# Altium schematic sheet schematic.SchDoc
size A3; SheetNumber: 6; SheetTotal: 29
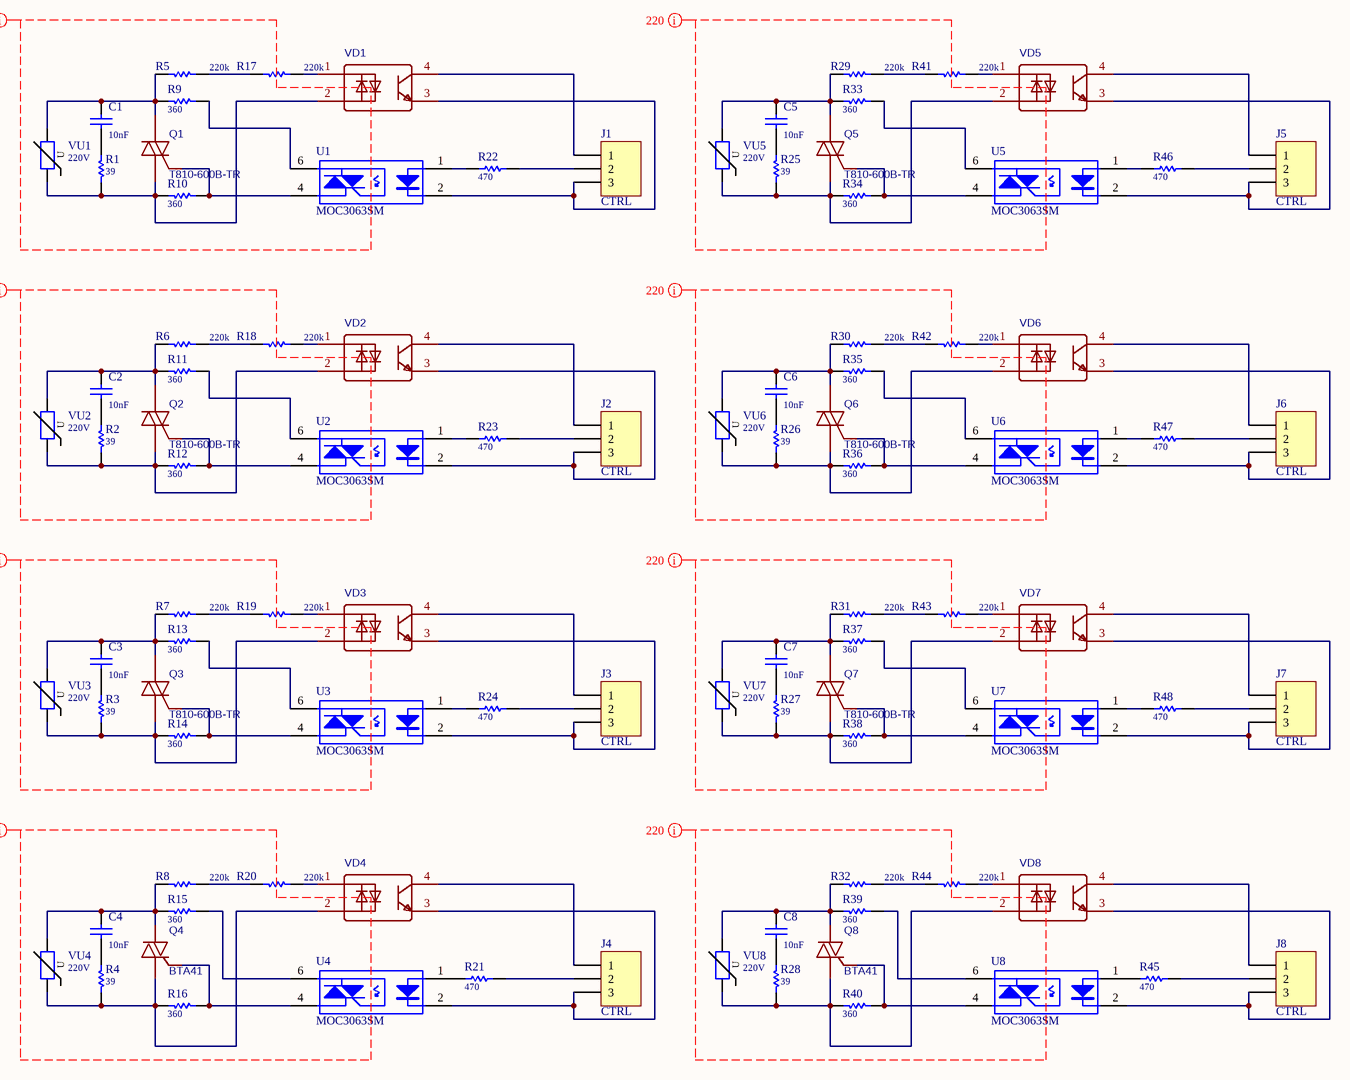
[diagram p0: schematic.SchDoc]

## Parts
C1  10nF  [C1206]
C2  10nF  [C1206]
C3  10nF  [C1206]
C4  10nF  [C1206]
C5  10nF  [C1206]
C6  10nF  [C1206]
C7  10nF  [C1206]
C8  10nF  [C1206]
J1  CTRL  [CONN_MOLEX_532610371]  (no BOM)
J2  CTRL  [CONN_MOLEX_532610371]  (no BOM)
J3  CTRL  [CONN_MOLEX_532610371]  (no BOM)
J4  CTRL  [CONN_MOLEX_532610371]  (no BOM)
J5  CTRL  [CONN_MOLEX_532610371]  (no BOM)
J6  CTRL  [CONN_MOLEX_532610371]  (no BOM)
J7  CTRL  [CONN_MOLEX_532610371]  (no BOM)
J8  CTRL  [CONN_MOLEX_532610371]  (no BOM)
Q1  T810-600B-TR  [TO-252AA (DPAK)]
Q2  T810-600B-TR  [TO-252AA (DPAK)]
Q3  T810-600B-TR  [TO-252AA (DPAK)]
Q4  BTA41  [TO-3P_L15.5-W4.6-P5.65-T]
Q5  T810-600B-TR  [TO-252AA (DPAK)]
Q6  T810-600B-TR  [TO-252AA (DPAK)]
Q7  T810-600B-TR  [TO-252AA (DPAK)]
Q8  BTA41  [TO-3P_L15.5-W4.6-P5.65-T]
R1  39  [R1206]
R2  39  [R1206]
R3  39  [R1206]
R4  39  [R1206]
R5  220k  [R1206]
R6  220k  [R1206]
R7  220k  [R1206]
R8  220k  [R1206]
R9  360  [R2512]
R10  360  [R2512]
R11  360  [R2512]
R12  360  [R2512]
R13  360  [R2512]
R14  360  [R2512]
R15  360  [R2512]
R16  360  [R2512]
R17  220k  [R1206]
R18  220k  [R1206]
R19  220k  [R1206]
R20  220k  [R1206]
R21  470  [R0603]
R22  470  [R0603]
R23  470  [R0603]
R24  470  [R0603]
R25  39  [R1206]
R26  39  [R1206]
R27  39  [R1206]
R28  39  [R1206]
R29  220k  [R1206]
R30  220k  [R1206]
R31  220k  [R1206]
R32  220k  [R1206]
R33  360  [R2512]
R34  360  [R2512]
R35  360  [R2512]
R36  360  [R2512]
R37  360  [R2512]
R38  360  [R2512]
R39  360  [R2512]
R40  360  [R2512]
R41  220k  [R1206]
R42  220k  [R1206]
R43  220k  [R1206]
R44  220k  [R1206]
R45  470  [R0603]
R46  470  [R0603]
R47  470  [R0603]
R48  470  [R0603]
U1  MOC3063SM  [SMD-6]
U2  MOC3063SM  [SMD-6]
U3  MOC3063SM  [SMD-6]
U4  MOC3063SM  [SMD-6]
U5  MOC3063SM  [SMD-6]
U6  MOC3063SM  [SMD-6]
U7  MOC3063SM  [SMD-6]
U8  MOC3063SM  [SMD-6]
VD1  EL3H4(A)(TA)-VG  [SOP-4_L4.4-W2.8-P1.27-LS7.0-TL]  (value not drawn)
VD2  EL3H4(A)(TA)-VG  [SOP-4_L4.4-W2.8-P1.27-LS7.0-TL]  (value not drawn)
VD3  EL3H4(A)(TA)-VG  [SOP-4_L4.4-W2.8-P1.27-LS7.0-TL]  (value not drawn)
VD4  EL3H4(A)(TA)-VG  [SOP-4_L4.4-W2.8-P1.27-LS7.0-TL]  (value not drawn)
VD5  EL3H4(A)(TA)-VG  [SOP-4_L4.4-W2.8-P1.27-LS7.0-TL]  (value not drawn)
VD6  EL3H4(A)(TA)-VG  [SOP-4_L4.4-W2.8-P1.27-LS7.0-TL]  (value not drawn)
VD7  EL3H4(A)(TA)-VG  [SOP-4_L4.4-W2.8-P1.27-LS7.0-TL]  (value not drawn)
VD8  EL3H4(A)(TA)-VG  [SOP-4_L4.4-W2.8-P1.27-LS7.0-TL]  (value not drawn)
VU1  220V  [SMC]
VU2  220V  [SMC]
VU3  220V  [SMC]
VU4  220V  [SMC]
VU5  220V  [SMC]
VU6  220V  [SMC]
VU7  220V  [SMC]
VU8  220V  [SMC]

## Nets
NetC1_1: C1.1 R1.2
NetC1_2: C1.2 Q1.2(T2) R5.1 R9.2 VU1.2
NetC2_1: C2.1 R2.2
NetC2_2: C2.2 Q2.2(T2) R6.1 R11.2 VU2.2
NetC3_1: C3.1 R3.2
NetC3_2: C3.2 Q3.2(T2) R7.1 R13.2 VU3.2
NetC4_1: C4.1 R4.2
NetC4_2: C4.2 Q4.2(T2) R8.1 R15.2 VU4.2
NetC5_1: C5.1 R25.2
NetC5_2: C5.2 Q5.2(T2) R29.1 R33.2 VU5.2
NetC6_1: C6.1 R26.2
NetC6_2: C6.2 Q6.2(T2) R30.1 R35.2 VU6.2
NetC7_1: C7.1 R27.2
NetC7_2: C7.2 Q7.2(T2) R31.1 R37.2 VU7.2
NetC8_1: C8.1 R28.2
NetC8_2: C8.2 Q8.2(T2) R32.1 R39.2 VU8.2
NetJ1_1: J1.1 VD1.4(Collector)
NetJ1_2: J1.2 R22.2
NetJ1_3: J1.3 U1.2(CATHODE) VD1.3(Emitter)
NetJ2_1: J2.1 VD2.4(Collector)
NetJ2_2: J2.2 R23.2
NetJ2_3: J2.3 U2.2(CATHODE) VD2.3(Emitter)
NetJ3_1: J3.1 VD3.4(Collector)
NetJ3_2: J3.2 R24.2
NetJ3_3: J3.3 U3.2(CATHODE) VD3.3(Emitter)
NetJ4_1: J4.1 VD4.4(Collector)
NetJ4_2: J4.2 R21.2
NetJ4_3: J4.3 U4.2(CATHODE) VD4.3(Emitter)
NetJ5_1: J5.1 VD5.4(Collector)
NetJ5_2: J5.2 R46.2
NetJ5_3: J5.3 U5.2(CATHODE) VD5.3(Emitter)
NetJ6_1: J6.1 VD6.4(Collector)
NetJ6_2: J6.2 R47.2
NetJ6_3: J6.3 U6.2(CATHODE) VD6.3(Emitter)
NetJ7_1: J7.1 VD7.4(Collector)
NetJ7_2: J7.2 R48.2
NetJ7_3: J7.3 U7.2(CATHODE) VD7.3(Emitter)
NetJ8_1: J8.1 VD8.4(Collector)
NetJ8_2: J8.2 R45.2
NetJ8_3: J8.3 U8.2(CATHODE) VD8.3(Emitter)
NetQ1_1: Q1.1(T1) R1.1 R10.1 VD1.2(Cathode_/_Anode) VU1.1
NetQ1_3: Q1.3(G) R10.2 U1.4(MAIN_TERM)
NetQ2_1: Q2.1(T1) R2.1 R12.1 VD2.2(Cathode_/_Anode) VU2.1
NetQ2_3: Q2.3(G) R12.2 U2.4(MAIN_TERM)
NetQ3_1: Q3.1(T1) R3.1 R14.1 VD3.2(Cathode_/_Anode) VU3.1
NetQ3_3: Q3.3(G) R14.2 U3.4(MAIN_TERM)
NetQ4_1: Q4.1(T1) R4.1 R16.1 VD4.2(Cathode_/_Anode) VU4.1
NetQ4_3: Q4.3(G) R16.2 U4.4(MAIN_TERM)
NetQ5_1: Q5.1(T1) R25.1 R34.1 VD5.2(Cathode_/_Anode) VU5.1
NetQ5_3: Q5.3(G) R34.2 U5.4(MAIN_TERM)
NetQ6_1: Q6.1(T1) R26.1 R36.1 VD6.2(Cathode_/_Anode) VU6.1
NetQ6_3: Q6.3(G) R36.2 U6.4(MAIN_TERM)
NetQ7_1: Q7.1(T1) R27.1 R38.1 VD7.2(Cathode_/_Anode) VU7.1
NetQ7_3: Q7.3(G) R38.2 U7.4(MAIN_TERM)
NetQ8_1: Q8.1(T1) R28.1 R40.1 VD8.2(Cathode_/_Anode) VU8.1
NetQ8_3: Q8.3(G) R40.2 U8.4(MAIN_TERM)
NetR5_2: R5.2 R17.1
NetR6_2: R6.2 R18.1
NetR7_2: R7.2 R19.1
NetR8_2: R8.2 R20.1
NetR9_1: R9.1 U1.6(MAIN_TERM)
NetR11_1: R11.1 U2.6(MAIN_TERM)
NetR13_1: R13.1 U3.6(MAIN_TERM)
NetR15_1: R15.1 U4.6(MAIN_TERM)
NetR17_2: R17.2 VD1.1(Anode_/_Cathode)
NetR18_2: R18.2 VD2.1(Anode_/_Cathode)
NetR19_2: R19.2 VD3.1(Anode_/_Cathode)
NetR20_2: R20.2 VD4.1(Anode_/_Cathode)
NetR21_1: R21.1 U4.1(ANODE)
NetR22_1: R22.1 U1.1(ANODE)
NetR23_1: R23.1 U2.1(ANODE)
NetR24_1: R24.1 U3.1(ANODE)
NetR29_2: R29.2 R41.1
NetR30_2: R30.2 R42.1
NetR31_2: R31.2 R43.1
NetR32_2: R32.2 R44.1
NetR33_1: R33.1 U5.6(MAIN_TERM)
NetR35_1: R35.1 U6.6(MAIN_TERM)
NetR37_1: R37.1 U7.6(MAIN_TERM)
NetR39_1: R39.1 U8.6(MAIN_TERM)
NetR41_2: R41.2 VD5.1(Anode_/_Cathode)
NetR42_2: R42.2 VD6.1(Anode_/_Cathode)
NetR43_2: R43.2 VD7.1(Anode_/_Cathode)
NetR44_2: R44.2 VD8.1(Anode_/_Cathode)
NetR45_1: R45.1 U8.1(ANODE)
NetR46_1: R46.1 U5.1(ANODE)
NetR47_1: R47.1 U6.1(ANODE)
NetR48_1: R48.1 U7.1(ANODE)

## Layout directives
net class 220: (no net found under the mark)

## Notes on the sheet
- (in symbol RES) U

## Library data of the parts
C1-C8 = CAP: 10nF 1kV 1206
J1-J8 = Header 3: 532610371
Q1-Q3 Q5-Q7 = BTA16F
R1-R4 R25-R28 = RES: 39R 1206
R5-R8 R17-R20 R29-R32 R41-R44 = RES: 220k 1206
R9-R16 R33-R40 = RES: 360R 2512
R21-R24 R45-R48 = RES: 470R 0603
U1-U8 = MOC3063SM: MOC3063S-TA1
VU1-VU8 = RES: 3225D471KJ